# Altium schematic sheet Sheet1.SchDoc
size B
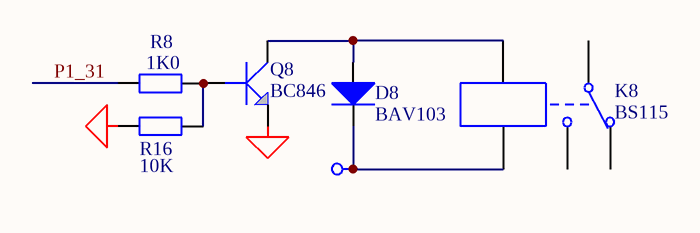
[diagram p0: Sheet1.SchDoc]

## Parts
D8  BAV103  [_1206d]
K8  BS115  [bs115]
Q8  BC846  [SO-G3]
R8  1K0  [_1206]
R16  10K  [_1206]

## Nets
+5v: D8.2(K) K8.5
GND: Q8.2(E) R16.1
P1_31: R8.1
NetD8_1: D8.1(A) K8.4 Q8.3(C)
NetQ8_1: Q8.1(B) R8.2 R16.2

Not connected (* = marked no-connect by the designer): K8 1 2 3

## Library data of the parts
D8 = Diode: Manufacturer: Generic Components; Class I: Discrete; Class II: Diode - Switching; Value: LL4148; Published: 8-Jun-2000; Revision: July-2002: Re-released for DXP Platform.; Publisher: Altium Limited
K8 = BS115: Single-Pole Dual-Throw Relay; Manufacturer: Generic Components; Class I: Electro-mechanical; Published: 24-Mar-1999; Revision: July-2002: Re-released for DXP Platform.; Publisher: Altium Limited; Class II: Relay
Q8 = GT122: Bipolar transistor; Right: 20; Bottom: 20; Value: BC846
R8 = Res2: Resistor; Manufacturer: Generic Components; Class I: Passive; Rule: Undefined; Published: 8-Jun-2000; Revision: July-2002: Re-released for DXP Platform.; Publisher: Altium Limited; Class II: Resistor; Value: 1K0
R16 = Res2: Resistor; Manufacturer: Generic Components; Class I: Passive; Published: 8-Jun-2000; Revision: July-2002: Re-released for DXP Platform.; Publisher: Altium Limited; Class II: Resistor; Value: 10K